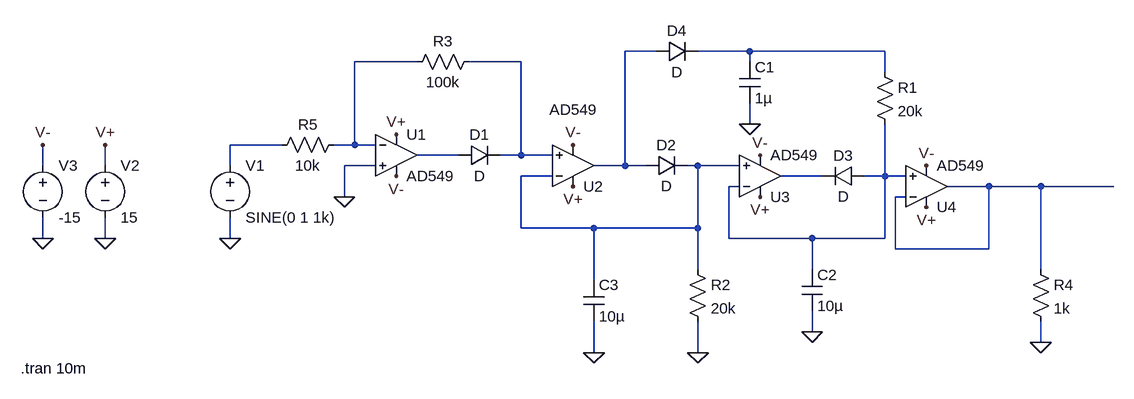
[diagram p0: schematic envelope det.asc]
envelope det.asc, the LTspice schematic file:
Version 4
SHEET 1 1204 680
WIRE 496 0 448 0
WIRE 640 0 560 0
WIRE 848 0 640 0
WIRE 128 16 32 16
WIRE 288 16 208 16
WIRE 640 16 640 0
WIRE 848 32 848 0
WIRE 640 112 640 80
WIRE -80 144 -160 144
WIRE 32 144 32 16
WIRE 32 144 0 144
WIRE 64 144 32 144
WIRE 192 160 128 160
WIRE 288 160 288 16
WIRE 288 160 256 160
WIRE 336 160 288 160
WIRE -448 176 -448 144
WIRE -352 176 -352 144
WIRE -160 176 -160 144
WIRE 64 176 16 176
WIRE 448 176 448 0
WIRE 448 176 400 176
WIRE 480 176 448 176
WIRE 560 176 544 176
WIRE 624 176 560 176
WIRE 336 192 288 192
WIRE 752 192 688 192
WIRE 848 192 848 112
WIRE 848 192 816 192
WIRE 880 192 848 192
WIRE 624 208 608 208
WIRE 1008 208 944 208
WIRE 1088 208 1008 208
WIRE 1200 208 1088 208
WIRE 16 224 16 176
WIRE 880 224 864 224
WIRE 288 272 288 192
WIRE 400 272 288 272
WIRE 560 272 560 176
WIRE 560 272 400 272
WIRE -448 288 -448 256
WIRE -352 288 -352 256
WIRE -160 288 -160 256
WIRE 608 288 608 208
WIRE 736 288 608 288
WIRE 848 288 848 192
WIRE 848 288 736 288
WIRE 864 304 864 224
WIRE 1008 304 1008 208
WIRE 1008 304 864 304
WIRE 560 336 560 272
WIRE 736 336 736 288
WIRE 1088 336 1088 208
WIRE 400 352 400 272
WIRE 736 432 736 400
WIRE 1088 448 1088 416
WIRE 400 464 400 416
WIRE 560 464 560 416
FLAG 96 128 V+
FLAG 96 192 V-
FLAG 368 208 V+
FLAG 368 144 V-
FLAG 656 224 V+
FLAG 656 160 V-
FLAG 912 240 V+
FLAG 912 176 V-
FLAG 736 432 0
FLAG 560 464 0
FLAG 400 464 0
FLAG 16 224 0
FLAG 640 112 0
FLAG 1088 448 0
FLAG -160 288 0
FLAG -352 144 V+
FLAG -448 144 V-
FLAG -352 288 0
FLAG -448 288 0
SYMBOL OpAmps\\AD549 96 96 R0
SYMATTR InstName U1
SYMBOL OpAmps\\AD549 368 240 M180
WINDOW 3 -36 150 Left 2
SYMATTR InstName U2
SYMBOL OpAmps\\AD549 656 256 M180
SYMATTR InstName U3
SYMBOL OpAmps\\AD549 912 272 M180
SYMATTR InstName U4
SYMBOL diode 192 176 R270
WINDOW 0 32 32 VTop 2
WINDOW 3 0 32 VBottom 2
SYMATTR InstName D1
SYMBOL diode 480 192 R270
WINDOW 0 32 32 VTop 2
WINDOW 3 0 32 VBottom 2
SYMATTR InstName D2
SYMBOL diode 816 176 R90
WINDOW 0 0 32 VBottom 2
WINDOW 3 32 32 VTop 2
SYMATTR InstName D3
SYMBOL diode 496 16 R270
WINDOW 0 32 32 VTop 2
WINDOW 3 0 32 VBottom 2
SYMATTR InstName D4
SYMBOL cap 624 16 R0
SYMATTR InstName C1
SYMATTR Value 1µ
SYMBOL res 832 16 R0
SYMATTR InstName R1
SYMATTR Value 20k
SYMBOL cap 720 336 R0
SYMATTR InstName C2
SYMATTR Value 10µ
SYMBOL res 544 320 R0
SYMATTR InstName R2
SYMATTR Value 20k
SYMBOL cap 384 352 R0
SYMATTR InstName C3
SYMATTR Value 10µ
SYMBOL res 224 0 R90
WINDOW 0 0 56 VBottom 2
WINDOW 3 32 56 VTop 2
SYMATTR InstName R3
SYMATTR Value 100k
SYMBOL res 1072 320 R0
SYMATTR InstName R4
SYMATTR Value 1k
SYMBOL voltage -160 160 R0
WINDOW 123 0 0 Left 0
WINDOW 39 0 0 Left 0
SYMATTR InstName V1
SYMATTR Value SINE(0 1 1k)
SYMBOL res 16 128 R90
WINDOW 0 0 56 VBottom 2
WINDOW 3 32 56 VTop 2
SYMATTR InstName R5
SYMATTR Value 10k
SYMBOL voltage -352 160 R0
WINDOW 123 0 0 Left 0
WINDOW 39 0 0 Left 0
SYMATTR InstName V2
SYMATTR Value 15
SYMBOL voltage -448 160 R0
WINDOW 123 0 0 Left 0
WINDOW 39 0 0 Left 0
SYMATTR InstName V3
SYMATTR Value -15
TEXT -482 488 Left 2 !.tran 10m

The netlist it stands for:
* envelope det.asc
XU1 0 N003 V+ V- N006 AD549  ; pins In+ In- V+ V- OUT
XU2 N004 N007 V+ V- N001 AD549  ; pins In+ In- V+ V- OUT
XU3 N007 N009 V+ V- N008 AD549  ; pins In+ In- V+ V- OUT
XU4 N009 N010 V+ V- N010 AD549  ; pins In+ In- V+ V- OUT
D1 N006 N004 D
D2 N001 N007 D
D3 N009 N008 D
D4 N001 N002 D
C1 N002 0 1µ
R1 N002 N009 20k
C2 N009 0 10µ
R2 N007 0 20k
C3 N007 0 10µ
R3 N004 N003 100k
R4 N010 0 1k
V1 N005 0 SINE(0 1 1k)
R5 N003 N005 10k
V2 V+ 0 15
V3 V- 0 -15
.model D D
.lib standard.dio
.tran 10m
.backanno
.end